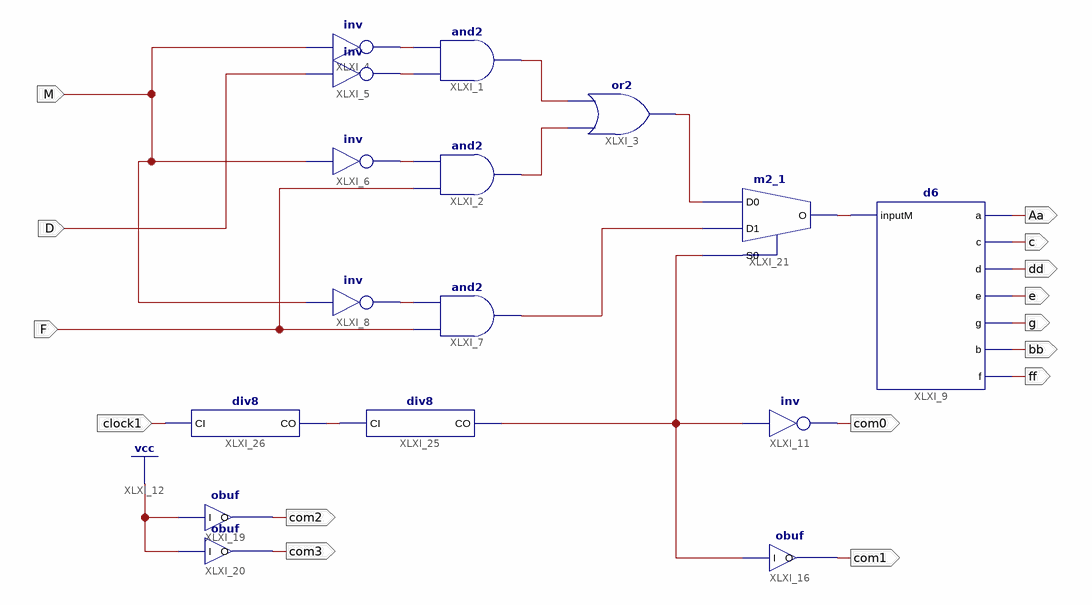
[diagram p0: schematic sheet 1]
// Xilinx ISE schematic tskmitl.sch (spartan6) as structural Verilog: 16 symbols, 15 ports
module tskmitl (
  input  D,
  input  F,
  input  M,
  input  clock1,
  output Aa,
  output c,
  output dd,
  output e,
  output g,
  output bb,
  output ff,
  output com0,
  output com1,
  output com3,
  output com2
);

  wire A, clock, XLXN_3, XLXN_4, XLXN_7, XLXN_8, XLXN_9, XLXN_10, XLXN_36, XLXN_37, XLXN_40;

  and XLXI_1 (XLXN_3, XLXN_8, XLXN_7);
  and XLXI_2 (XLXN_4, F, XLXN_9);
  or XLXI_3 (XLXN_37, XLXN_4, XLXN_3);
  not XLXI_4 (XLXN_7, M);
  not XLXI_5 (XLXN_8, D);
  not XLXI_6 (XLXN_9, M);
  and XLXI_7 (A, F, XLXN_10);
  not XLXI_8 (XLXN_10, M);
  d6 XLXI_9 (.a(Aa), .b(bb), .c(c), .d(dd), .e(e), .f(ff), .g(g), .inputM(XLXN_36));
  not XLXI_11 (com0, clock);
  obuf XLXI_16 (.I(clock), .O(com1));
  m2_1 XLXI_21 (.D0(XLXN_37), .D1(A), .S0(clock), .O(XLXN_36));
  obuf XLXI_20 (.I(1'b1), .O(com3));
  obuf XLXI_19 (.I(1'b1), .O(com2));
  div8 XLXI_25 (.CI(XLXN_40), .CO(clock));
  div8 XLXI_26 (.CI(clock1), .CO(XLXN_40));
endmodule
